# Altium schematic sheet USB.SchDoc
size A3; SheetNumber: 6; SheetTotal: 8
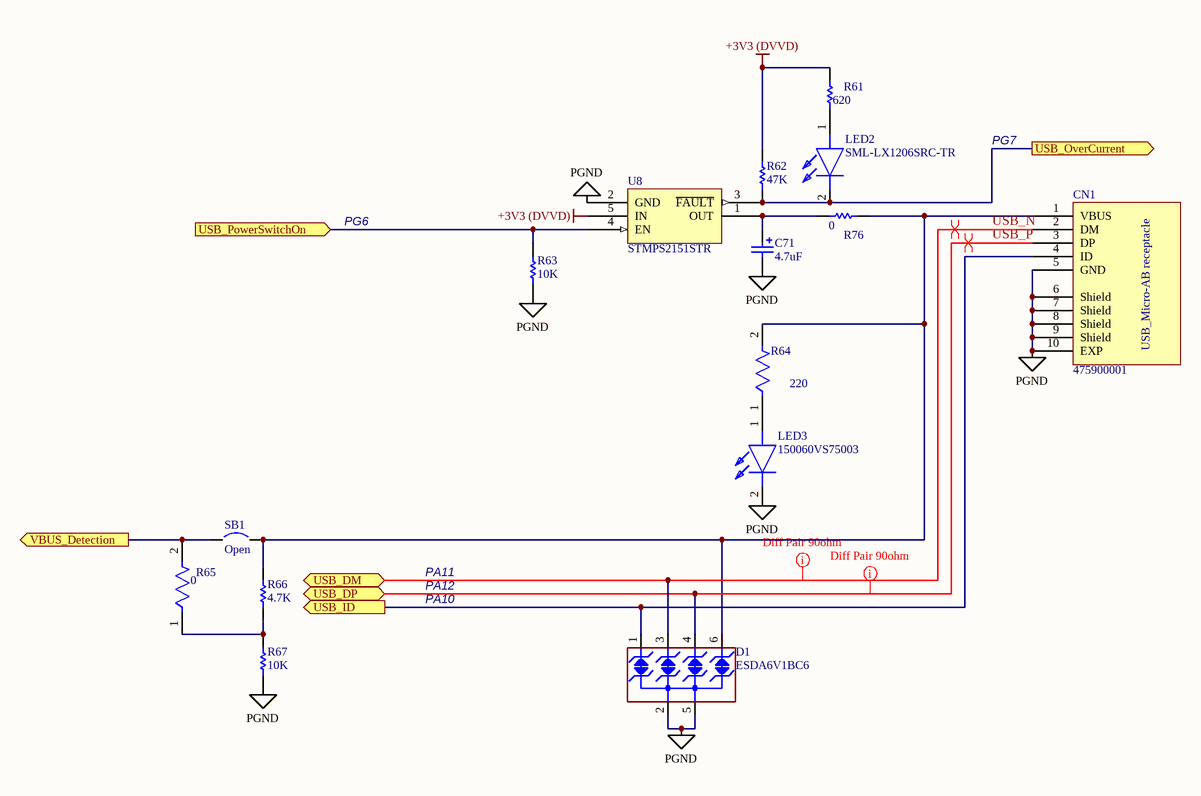
[diagram p0: USB.SchDoc]

## Parts
C71  4.7uF  [TAN-A]
CN1  475900001  [MOLEX_47590001]
D1  ESDA6V1BC6  [3]
LED2  SML-LX1206SRC-TR  [SMLLX1206SRCTR]
LED3  150060VS75003  [150060VS75003]
R61  620  [0603R]
R62  47K  [0603R]
R63  10K  [0603R]
R64  220  [FP-CRCW0805-e3-MFG]
R65  0  [FP-CRCW1206-MFG]
R66  4.7K  [0603R]
R67  10K  [0603R]
R76  0  [RESC2013X70X40NL20T20]
SB1  Open  [SB_0603]
U8  STMPS2151STR  [SOT-23-5L]

## Ports
USB_DM (bidir, see MCU[2B]), USB_DP (bidir, see MCU[2B]), USB_ID (out, see MCU[2B]), USB_OverCurrent (out, see MCU[2B]), USB_PowerSwitchOn (in, see MCU[1B]), VBUS_Detection (out, see MCU[2B])

## Nets
+3V3 (DVVD): R61.2 R62.1 U8.5(IN)
PGND: C71.2 CN1.5(GND) CN1.6(Shield) CN1.7(Shield) CN1.8(Shield) CN1.9(Shield) CN1.10(EXP) D1.2(IO2) D1.5(IO4) LED3.2(K) R63.1 R67.2 U8.2(GND)
USB_ID: CN1.4(ID) D1.1(IO1) ; port USB_ID
USB_N: CN1.2(DM) D1.3(GND) ; port USB_DM
USB_OverCurrent: LED2.2(K) R62.2 U8.3(~{FAULT}) ; port USB_OverCurrent
USB_P: CN1.3(DP) D1.4(IO3) ; port USB_DP
USB_PowerSwitchOn: R63.2 U8.4(EN) ; port USB_PowerSwitchOn
VBUS_Detection: R65.2 SB1.1 ; port VBUS_Detection
NetC71_1: C71.1 R76.1 U8.1(OUT)
NetCN1_1: CN1.1(VBUS) D1.6(NC) R64.2 R66.1 R76.2 SB1.2
NetLED2_1: LED2.1(A) R61.1
NetLED3_1: LED3.1(A) R64.1
NetR65_1: R65.1 R66.2 R67.1

## Layout directives
mark named Diff Pair 90ohm: USB_N, USB_P
differential pair: USB_N, USB_P

## Notes on the sheet
- PG7
- PG6
- PA11
- PA10
- PA12
- (in symbol 475900001) USB_Micro-AB receptacle

## Library data of the parts
C71 = Cap Pol1: Polarized Capacitor (Radial); Value: 47uF; Published: 8-Jun-2000; Revision: July-2002: Re-released for DXP Platform.; Publisher: Altium Limited
D1 = ESDA6V1BC6: 4-line ESD protection; Manuf_1: STM; Manuf_Part_1: ESDA5V3L; Ref St: 9179034; Provided: ST; ECCN_US/EU: EAR99/NEC; Distrib: ST; Order: ESDA5V3L; Ordered by: STM
LED2 = SML-LX1206SRC-TR: LED; Manufacturer_Name: Lumex; Datasheet Link: https://www.mouser.com/datasheet/2/244/lumex_lumxs08806-1-1737896.pdf; Manufacturer_Part_Number: SML-LX1206SRC-TR; Mouser Part Number: 696-SML-LX1206SRC; Mouser Price/Stock: https://www.mouser.co.uk/ProductDetail/Lumex/SML-LX1206SRC-TR?qs=0O4ZBxfQx6vySOktj4gTCg%3D%3D; Arrow Part Number: SML-LX1206SRC-TR; Arrow Price/Stock: https://www.arrow.com/en/products/sml-lx1206src-tr/lumex?region=nac
LED3 = 150060VS75003: LED; Manufacturer_Name: Wurth Elektronik; Datasheet Link: https://www.we-online.com/catalog/datasheet/150060VS75003.pdf; Height: 0.8mm; Manufacturer_Part_Number: 150060VS75003; Mouser Part Number: 710-150060VS75003; Mouser Price/Stock: https://www.mouser.co.uk/ProductDetail/Wurth-Elektronik/150060VS75003?qs=Li%252BoUPsLEnv2ZkbQUMi3uQ%3D%3D
R61 R63 = Res1: Resistor; Value: 1K; Published: 8-Jun-2000; Revision: July-2002: Re-released for DXP Platform.; Publisher: Altium Limited
R62 R66 R67 = res1: Resistor; Value: 1K; Published: 8-Jun-2000; Revision: July-2002: Re-released for DXP Platform.; Publisher: Altium Limited
R64 = CMP-2001-03682-2: RES Thick Film, 220Ω, 1%, 0.125W, 100ppm/°C, 0805; Max Power Dissipation: 125mW; Voltage Rating: 150V; Resistance: 220R; Packaging: Tape and Reel; Termination: SMD/SMT; Height: 0.45mm; Package Quantity: 10; Width: 0.049inch; Min Operating Temperature: -55°C; Lead Free: Lead Free; Military Standard: Not; Mount: Surface Mount; Max Operating Temperature: 155°C; Voltage Rating (DC): 150V; Composition: Thick Film; Case/Package: 0805; Length: 2mm; Weight: 0.000194oz; Case Code (Metric): 2012; Number of Terminations: 2; Case Code (Imperial): 0805; Radiation Hardening: No; Tolerance: 1%; Features: Automotive AEC-Q200; Power Rating: 125mW; Depth: 1.25mm; Contact Plating: Tin; Temperature Coefficient: 100ppm/°C
R65 = CMP-00030-39388935-1: CRCW12060000ZSTA Zero Ohm Resistor, Jumper, 1206 [3216 Metric], Thick Film, 250 mW, Surface Mount; Voltage Rating (DC): 200V; Max Power Dissipation: 250mW; Temperature Coefficient: 100ppm/°C; Resistance: 0Ω; Packaging: Cut Tape; Lead Free: Contains Lead; Height: 609.6µm; Military Standard: Not; Min Operating Temperature: -55°C; Weight: 10.007382mg; Depth: 1.6mm; Termination: SMD/SMT; Mount: Surface Mount; RoHS: Compliant; Case Code (Metric): 3216; Max Operating Temperature: 155°C; NexarPartId: 39388935; Length: 3.2mm; Features: Automotive AEC-Q200; Case Code (Imperial): 1206; Composition: Thick Film; Case/Package: 1206; Voltage Rating: 200V; Width: 1.6mm; Contact Plating: Lead, Tin; Number of Terminations: 2; REACH SVHC: Unknown; Power Rating: 250mW; Radiation Hardening: No
R76 = CMP-1665-00002-5: Chip Resistor, 0 Ohm, +/- 1%, 0.125 W, -55 to 155 degC, 0805 (2012 Metric), RoHS, Tape and Reel; PartNumber: ERJ-6GEY0R00V; Tolerance: 5%; Resistance: 0 Ohm; REACH SVHC: No SVHC; Min Operating Temperature: -55 degC; Case/Package: 0805; Packaging: Tape and Reel; Package Quantity: 5000; ComponentLink1Description: Manufacturer URL; PackageDescription: 2-Pin Surface Mount Device, Body 2 x 1.25 mm; Mounting Technology: Surface Mount; Max Operating Temperature: 155 degC; Width: 1.25 mm; RoHSCompliant: True; Height: 0.6 mm; ComponentLink1URL: http://www.panasonic.com/; ComponentLink2URL: http://industrial.panasonic.com/cdbs/www-data/pdf/RDA0000/AOA0000C84.pdf; Case Code (Imperial): 0805; DatasheetVersion: 03/2015; Length: 2 mm; Case Code (Metric): 2012; ComponentLink2Description: Datasheet; Radiation Hardening: No
SB1 = Circuit Breaker: Published: 24-Mar-1999; Revision: July-2002: Re-released for DXP Platform.; Publisher: Altium Limited
U8 = STMPS2141STR